# EAGLE design 20140217_FT_1.2b (EAGLE 6.5.0)
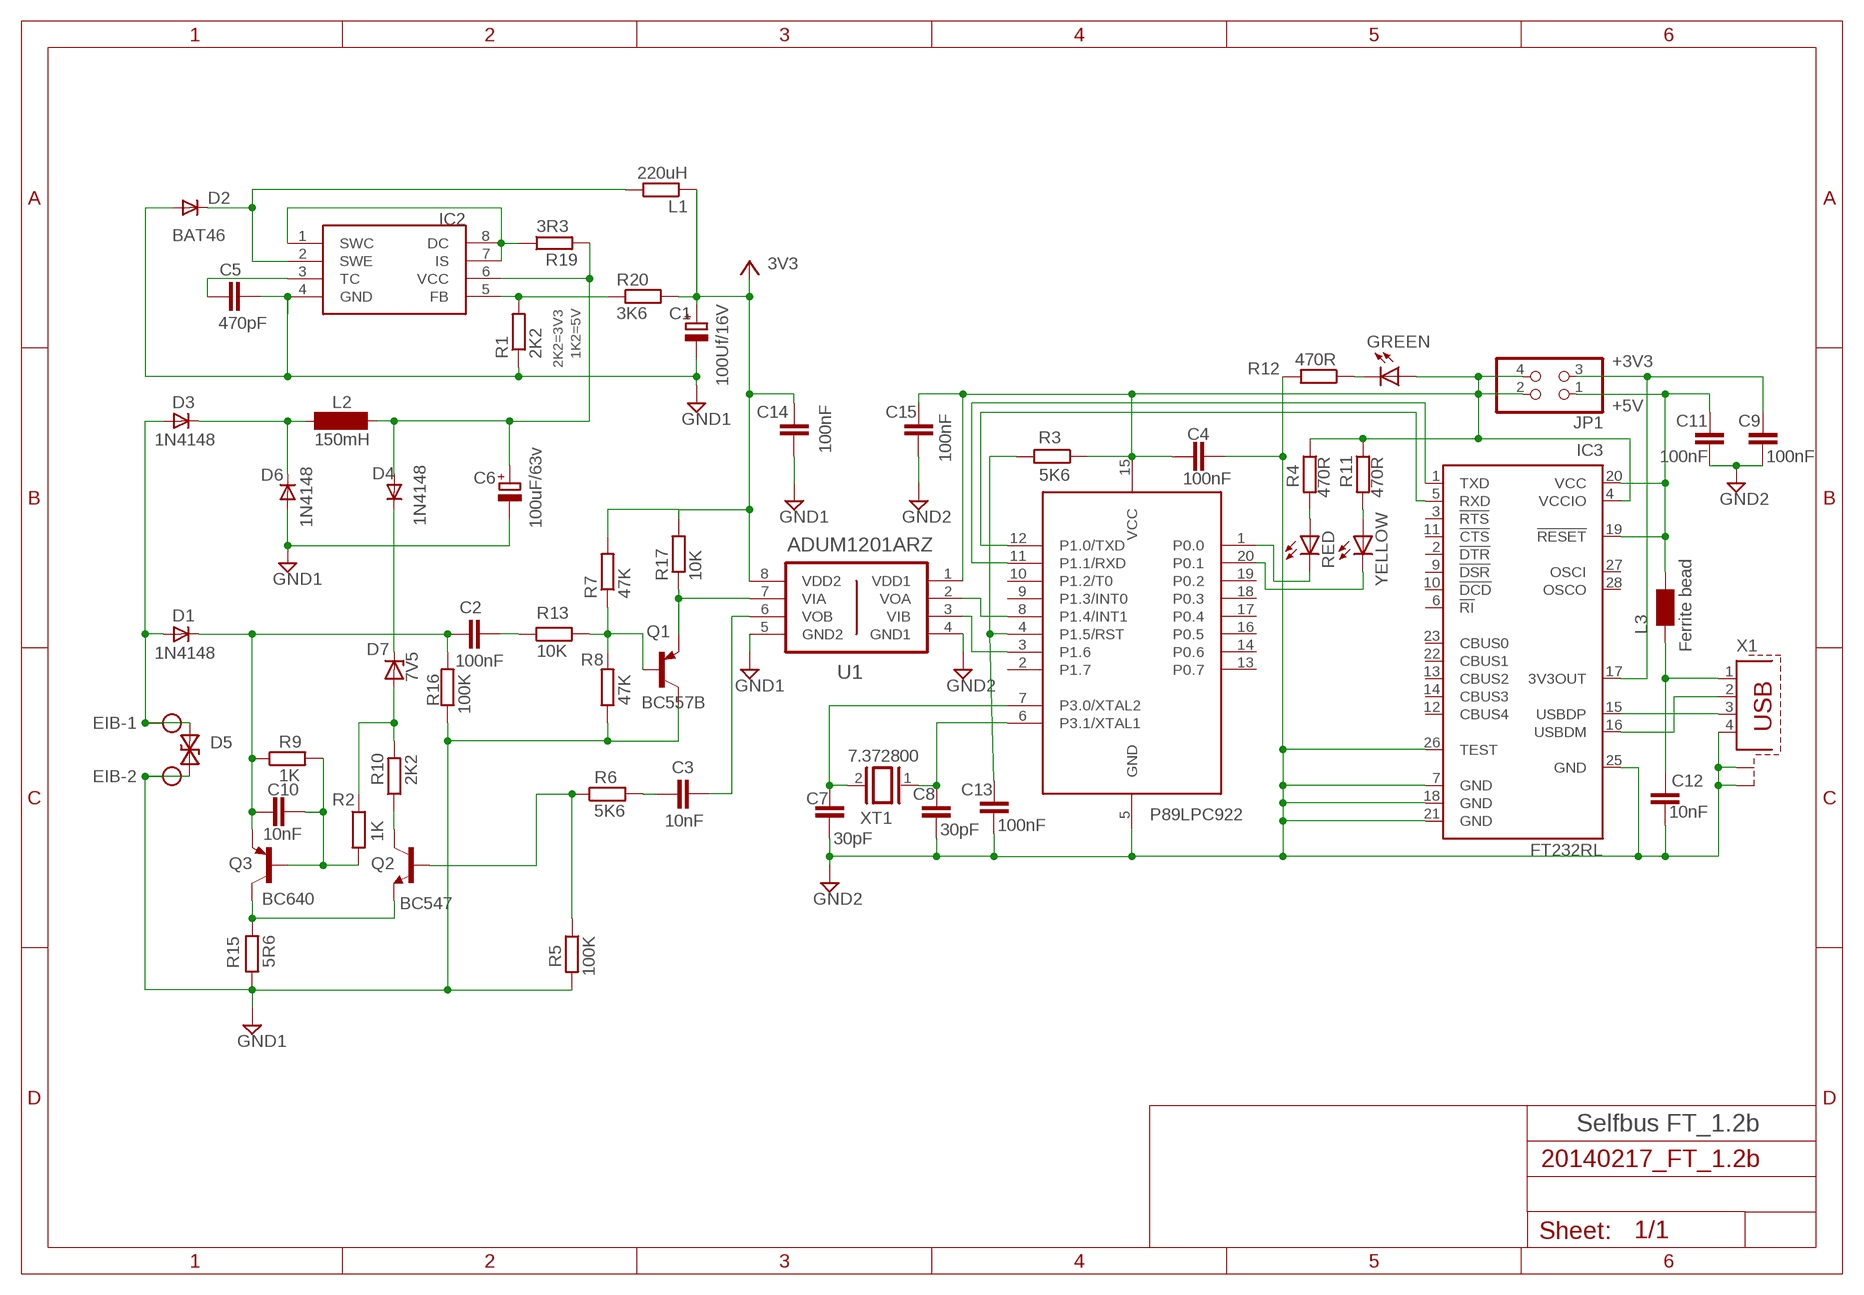
[diagram p0: schematic, sheet 1]

## Parts
C1  100Uf/16V  CPOL-EUE2.5-6  [E2,5-6]
C2  100nF  C-EUC0805  [C0805]
C3  10nF  C-EUC0805  [C0805]
C4  100nF  C-EUC0805  [C0805]
C5  470pF  C-EUC0805  [C0805]
C6  100uF/63v  CPOL-EUE5-8.5  [E5-8,5]
C7  30pF  C-EUC0805  [C0805]
C8  30pF  C-EUC0805  [C0805]
C9  100nF  C-EUC0805  [C0805]
C10  10nF  C-EUC0805  [C0805]
C11  100nF  C-EUC0805  [C0805]
C12  10nF  C-EUC0805  [C0805]
C13  100nF  C-EUC0805  [C0805]
C14  100nF  C-EUC0805  [C0805]
C15  100nF  C-EUC0805  [C0805]
D1  1N4148  LL4148  [SOD80_DO213AA_MINIMELF]
D2  BAT46  LL4148  [SOD80_DO213AA_MINIMELF]
D3  1N4148  LL4148  [SOD80_DO213AA_MINIMELF]
D4  1N4148  LL4148  [SOD80_DO213AA_MINIMELF]
D5  SMAJ43CA  [SMA]
D6  1N4148  LL4148  [SOD80_DO213AA_MINIMELF]
D7  7V5  ZENER-DIODESOD80C  [SOD80C]
EIB  MKDSN1,5/2-5,08  [MKDSN1,5/2-5,08]
GREEN  LED3MM  [LED3MM]
IC1  89LPC922  [DIL20]
IC2  MC34063AP  [DIL08]
IC3  FT232RL  [SSOP28]
JP1  PINHD-2X2  [2X02]
L1  220uH  R-EU_0207/10  [0207/10]
L2  150mH  SD12-1000  [SD12_1000]
L3  Ferrite bead  WE-CBF_0805  [0805]
Q1  BC557B  BC557  [TO92-EBC]
Q2  BC547  BC548  [TO92-EBC]
Q3  BC640  [TO92-BCE]
R1  2K2  R-EU_R0805  [R0805]
R2  1K  R-EU_R0805  [R0805]
R3  5K6  R-EU_R0805  [R0805]
R4  470R  R-EU_R0805  [R0805]
R5  100K  R-EU_R0805  [R0805]
R6  5K6  R-EU_R0805  [R0805]
R7  47K  R-EU_R0805  [R0805]
R8  47K  R-EU_R0805  [R0805]
R9  1K  R-EU_R0805  [R0805]
R10  2K2  R-EU_R0805  [R0805]
R11  470R  R-EU_R0805  [R0805]
R12  470R  R-EU_R0805  [R0805]
R13  10K  R-EU_R0805  [R0805]
R15  5R6  R-EU_0204/7  [0204/7]
R16  100K  R-EU_R0805  [R0805]
R17  10K  R-EU_R0805  [R0805]
R19  3R3  R-EU_R0805  [R0805]
R20  3K6  R-EU_R0805  [R0805]
RED  LED3MM  [LED3MM]
U1  ADUM1201ARZ  [SOIC127P600X175-8N]
X1  PN61729-S  [PN61729-S]
XT1  7.372800  XTAL/S  [QS]
YELLOW  LED3MM  [LED3MM]

## Nets
DRAIN: C2.1 C10.1 D1.C Q3.E R9.1 R16.2
N$1: C3.1 R6.2
N$2: C2.2 R13.1
N$3: IC2.5(FB) R1.2 R20.1
N$4: IC2.1(SWC) IC2.7(IS) IC2.8(DC) R19.1
N$5: C3.2 U1.6(VOB)
N$6: Q2.C R10.1
N$7: Q2.E Q3.C R15.2
N$8: D3.C D6.C L2.1
N$9: D4.C D7.C
N$12: Q2.B R5.1 R6.1
N$13: C5.1 IC2.3(TC)
N$14: Q1.B R7.1 R8.2 R13.2
N$16: D1.A D3.A D5.2 EIB.1
N$18: C4.2 C15.2 GREEN.A IC1.15(VCC) IC3.4(VCCIO) JP1.2 JP1.4 R3.1 R4.1 R11.1 U1.1(VDD1)
N$19: C8.2 IC1.6(P3.1/XTAL1) XT1.1
N$20: IC1.11(P1.1/RXD) IC3.1(TXD)
N$21: C13.2 IC1.4(P1.5/RST) R3.2
N$22: IC1.12(P1.0/TXD) IC3.5(RXD)
N$23: R4.2 RED.A
N$24: R11.2 YELLOW.A
N$25: IC1.20(P0.1) YELLOW.K(C)
N$26: IC1.1(P0.0) RED.K(C)
N$27: C11.1 IC3.19(!RESET) IC3.20(VCC) JP1.1 L3.2
N$28: IC3.15(USBDP) X1.3
N$29: IC3.16(USBDM) X1.2
N$30: C9.1 IC3.17(3V3OUT) JP1.3
N$33: C12.1 L3.1 X1.1
N$35: GREEN.K(C) R12.1
N$43: C6.+ D4.A IC2.6(VCC) L2.2 R19.2
N$46: IC1.8(P1.4/INT1) U1.2(VOA)
N$50: R7.2 R17.2
N$52: D2.C IC2.2(SWE) L1.2
N$58: IC1.3(P1.6) U1.3(VIB)
N$62: C1.- C5.2 C6.- C14.1 D2.A D5.1 D6.A EIB.2 IC2.4(GND) Q1.C R1.1 R5.2 R8.1 R15.1 R16.1 U1.5(GND2) ; supply symbol labelled GND1
N$65: C4.1 C7.1 C8.1 C9.2 C11.2 C12.2 C13.1 C15.1 IC1.5(GND) IC3.7(GND) IC3.18(GND) IC3.21(GND) IC3.25(GND) IC3.26(TEST) R12.2 U1.4(GND1) X1.4 X1.S1 X1.S2 ; supply symbol labelled GND2
N$77: C1.+ C14.2 L1.1 R20.2 U1.8(VDD2) ; supply symbol labelled 3V3
N$93: C10.2 Q3.B R2.2 R9.2
N$98: Q1.E R17.1 U1.7(VIA)
N$104: C7.2 IC1.7(P3.0/XTAL2) XT1.2
REF: D7.A R2.1 R10.2
Unconnected: IC1.2(P1.7) IC1.9(P1.3/INT0) IC1.10(P1.2/T0) IC1.13(P0.7) IC1.14(P0.6) IC1.16(P0.5) IC1.17(P0.4) IC1.18(P0.3) IC1.19(P0.2) IC3.2(!DTR) IC3.3(!RTS) IC3.6(!RI) IC3.9(!DSR) IC3.10(!DCD) IC3.11(!CTS) IC3.12(CBUS4) IC3.13(CBUS2) IC3.14(CBUS3) IC3.22(CBUS1) IC3.23(CBUS0) IC3.27(OSCI) IC3.28(OSCO)

## Notes on the sheet
- 1K2=5V
- 2K2=3V3 | +3V3
- +5V
- P89LPC922
- Selfbus FT_1.2b

## Library data of the parts
C1 C6 = rcl:CPOL-EU: POLARIZED CAPACITOR, European symbol
C2-C5 C7-C15 = rcl:C-EU: CAPACITOR, European symbol
D1-D4 D6 = diodes_smd:LL4148: 1N4148 General Purpose Rectifie SMD-Version of 1N4148 Case: SOD 80 = DO 213 AA = MINIMELF (Glass) Author: Dipl.-Ing. FH Rainer Bayer HHN Hochschule Heilbronn, rainer.bayer@hs-heilbronn.de Ingenieurbüro ing-rb, mail@ing-rb.de
D5 = SMAJ_SM6T_P6SMB:SMAJ*CA: SMAJxxCA Series of bidirectional Transient Voltage Suppressor Diodes xx = Stand-off Voltage VR in Volts; PPM = 400 W (300 W) @ 10/1000 us; IFSM = 40 A Case: SMA = DO214 AC Author: Dipl.-Ing. FH Rainer Bayer, www.ing-rb.de/hhn Feedback: rainer.bayer@hs-heilbronn.de
D7 = diode:ZENER-DIODE: Z-Diode
EIB = con-phoenix-508:MKDSN1,5/2-5,08: MKDSN 1,5/ 2-5,08 Printklemme Nennstrom: 13,5 A Nennspannung: 250 V Rastermaß: 5,08 mm Polzahl: 2 Anschlussart: Schraubanschluss Montage: Löten Anschlussrichtung Leiter/Platine: 0 ° Artikelnummer: 1729128 Source: http://eshop.phoenixcontact.com .. 1729128.pdf; MPN: MKDSN 1,5/2-5.08; OC_FARNELL: 1792903; OC_NEWARK: 30M2397
GREEN RED YELLOW = led:LED: LED OSRAM: - CHIPLED LG R971, LG N971, LY N971, LG Q971, LY Q971, LO R971, LY R971 LH N974, LH R974 LS Q976, LO Q976, LY Q976 LO Q996 - Hyper CHIPLED LW Q18S LB Q993, LB Q99A, LB R99A - SideLED LS A670, LO A670, LY A670, LG A670, LP A670 LB A673, LV A673, LT A673, LW A673 LH A674 LY A675 LS A676, LA A676, LO A676, LY A676, LW A676 LS A679, LY A679, LG A679 - Hyper Micro SIDELED® LS Y876, LA Y876, LO Y876, LY Y876 LT Y87S - SmartLED LW L88C, LW L88S LB L89C, LB L89S, LG L890 LS L89K, LO L89K, LY L89K LS L896, LA L896, LO L896, LY L896 - TOPLED LS T670, LO T670, LY T670, LG T670, LP T670 LSG T670, LSP T670, LSY T670, LOP T670, LYG T670 LG T671, LOG T671, LSG T671 LB T673, LV T673, LT T673, LW T673 LH T674 LS T676, LA T676, LO T676, LY T676, LB T676, LH T676, LSB T676, LW T676 LB T67C, LV T67C, LT T67C, LS T67K, LO T67K, LY T67K, LW E67C LS E67B, LA E67B, LO E67B, LY E67B, LB E67C, LV E67C, LT E67C LW T67C LS T679, LY T679, LG T679 LS T770, LO T770, LY T770, LG T770, LP T770 LB T773, LV T773, LT T773, LW T773 LH T774 LS E675, LA E675, LY E675, LS T675 LS T776, LA T776, LO T776, LY T776, LB T776 LHGB T686 LT T68C, LB T68C - Hyper Mini TOPLED® LB M676 - Mini TOPLED Santana® LG M470 LS M47K, LO M47K, LY M47K Source: http://www.osram.convergy.de LUXEON: - LUMILED® LXK2-PW12-R00, LXK2-PW12-S00, LXK2-PW14-U00, LXK2-PW14-V00 LXK2-PM12-R00, LXK2-PM12-S00, LXK2-PM14-U00 LXK2-PE12-Q00, LXK2-PE12-R00, LXK2-PE12-S00, LXK2-PE14-T00, LXK2-PE14-U00 LXK2-PB12-K00, LXK2-PB12-L00, LXK2-PB12-M00, LXK2-PB14-N00, LXK2-PB14-P00, LXK2-PB14-Q00 LXK2-PR12-L00, LXK2-PR12-M00, LXK2-PR14-Q00, LXK2-PR14-R00 LXK2-PD12-Q00, LXK2-PD12-R00, LXK2-PD12-S00 LXK2-PH12-R00, LXK2-PH12-S00 LXK2-PL12-P00, LXK2-PL12-Q00, LXK2-PL12-R00 Source: www.luxeon.com KINGBRIGHT: KA-3528ASYC Source: www.kingbright.com
IC1 = micro-philips:89LPC922
IC2 = mc34063:MC34063
IC3 = ftdichip:FT232R: Source: http://www.ftdichip.com/Documents/DataSheets/DS_FT232R_v104.pdf
JP1 = pinhead:PINHD-2X2: PIN HEADER
L1 R1-R13 R15-R17 R19 R20 = rcl:R-EU_: RESISTOR, European symbol
L2 = inductor-neosid:SD12: INDUCTOR nominal inductance
L3 = wuerth-elektronik:WE-CBF: SMD EMI Suppression Ferrite Beads - excellent anti-EMI properties - low DCR - impedances till 3000 ohms - rated current up to 6 A
Q1 = transistor-pnp:BC557*: PNP Transistror
Q2 = transistor-npn:BC548*: NPN Transistor
Q3 = transistor-pnp:BC640*: PNP Transistror
U1 = ADUM1201ARZ:ADUM1201ARZ: Dual-Channel Digital Isolators; MPN: ADUM1201ARZ; OC_FARNELL: 1078200; OC_NEWARK: 19M0753; PACKAGE: SOIC-8; SUPPLIER: Analog Devices
X1 = con-berg:PN61729-S: BERG USB connector; OC_FARNELL: unknown; OC_NEWARK: unknown
XT1 = special:XTAL/S: CRYSTAL

## Board
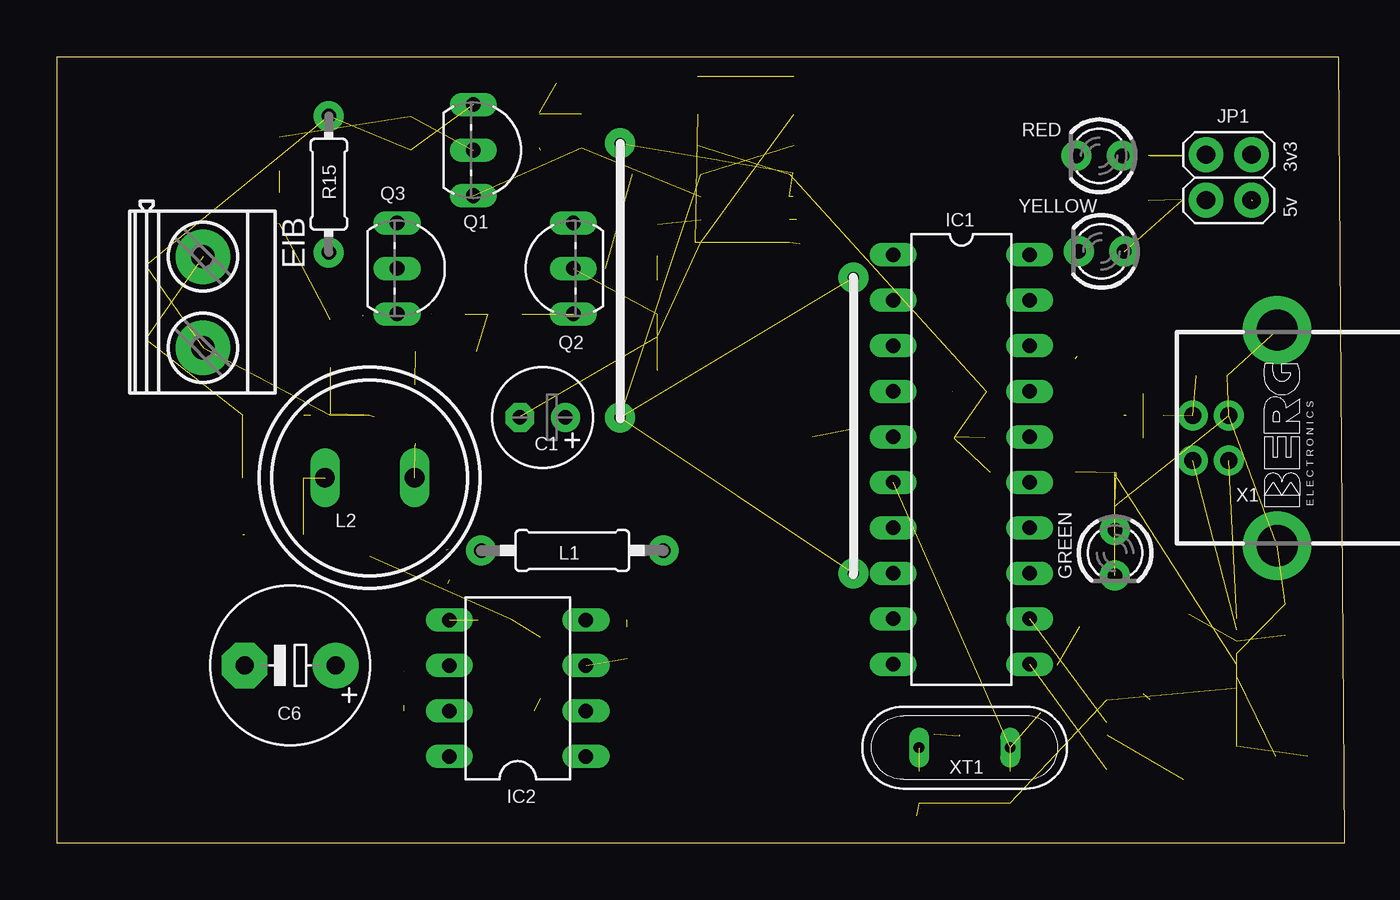
[diagram p1: board, top side]
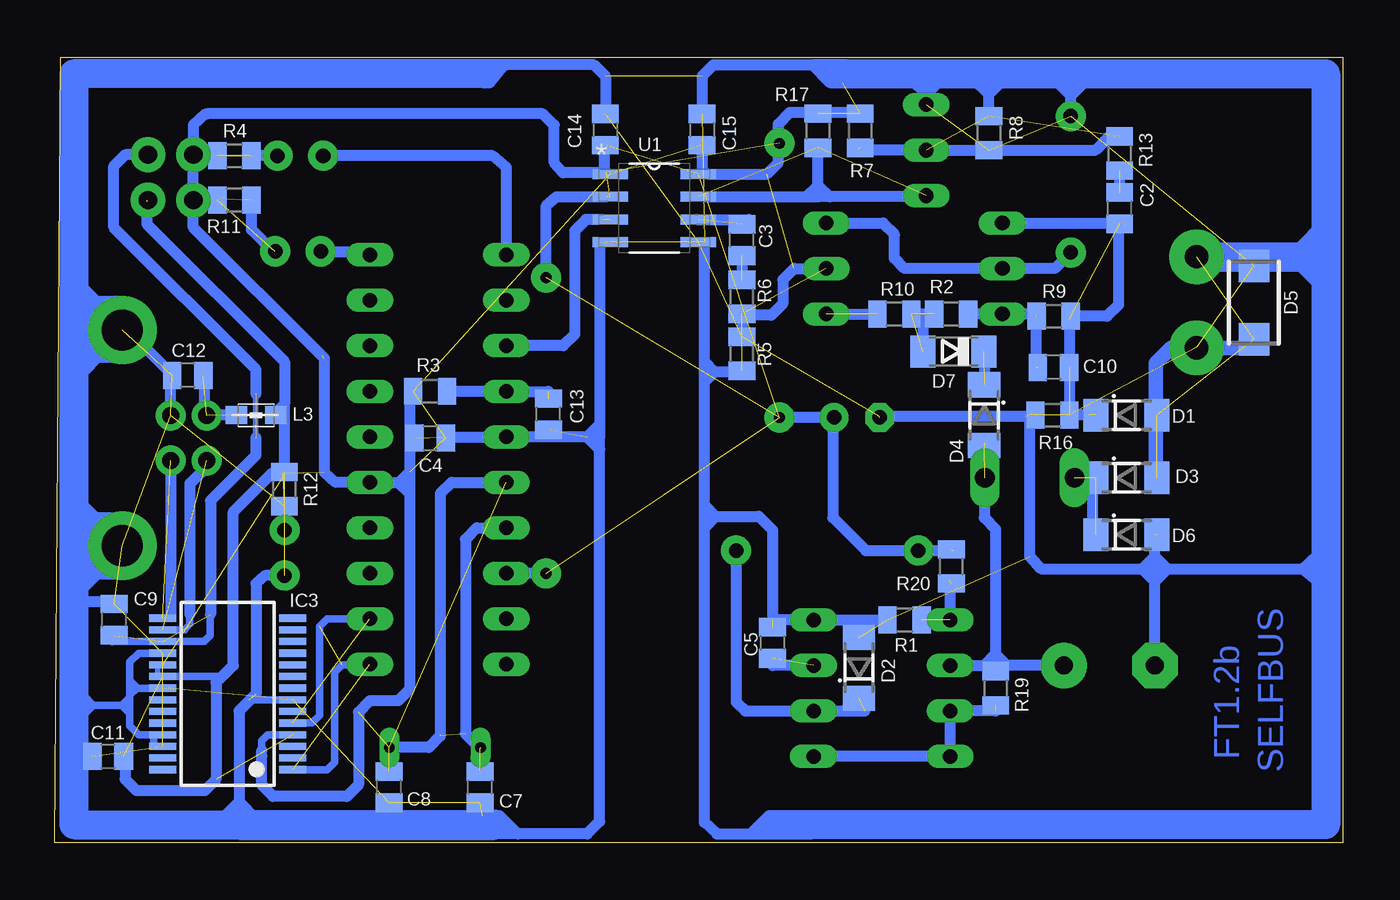
[diagram p2: board, bottom side, seen from below]

Size 71.86 x 43.87 mm. Coordinates in mm from the lower left corner, seen from the top.
Outline: 0,0 71.86,0 71.54,43.87 0,43.87 0,0
Copper layers (1*16): Top 0.035mm / dielectric 1.5mm / Bottom 0.035mm
Design rules "default": minimum track width 10mil, minimum drill 24mil, track to track 8mil, track to pad 8mil, pad to pad 8mil, via to via 8mil, smd to smd 8mil, copper to edge 40mil, drill to drill 8mil, minimum pad ring 10mil, minimum via ring 8mil, stop-mask expansion 4mil, vias tented up to drill 0mil, thermal gap 10mil

### Footprints (pad centres in the part's own frame; a part is rotated, then mirrored left to right if it is on the bottom)
E2,5-6 = drill 0.813 pad 1.6: + -1.27,0 | drill 0.813 pad 1.6 octagon: - 1.27,0
C0805 = smd 1.041 x 1.5: 1 -0.874,0 | smd 1.016 x 1.5: 2 0.874,0
E5-8,5 = drill 1.016 pad 2.54: + -2.54,0 | drill 1.016 pad 2.54 octagon: - 2.54,0
SOD80_DO213AA_MINIMELF = smd 1.4 x 1.8: A 1.7,0; C -1.7,0
SMA = smd 1.8 x 1.7: 1 -2.05,0; 2 2.05,0
SOD80C = smd 1.4 x 1.8: A 1.7,0; C -1.7,0
MKDSN1,5/2-5,08 = drill 1.3 pad 3.048: 1 -2.561,0.025; 2 2.519,0.025
LED3MM = drill 0.813 pad 1.676: A -1.27,0; K 1.27,0
DIL20 = drill 0.813 long: 1 -11.43,-3.81; 2 -8.89,-3.81; 3 -6.35,-3.81; 4 -3.81,-3.81; 5 -1.27,-3.81; 6 1.27,-3.81; 7 3.81,-3.81; 8 6.35,-3.81; 9 8.89,-3.81; 10 11.43,-3.81; 11 11.43,3.81; 12 8.89,3.81; 13 6.35,3.81; 14 3.81,3.81; 15 1.27,3.81; 16 -1.27,3.81; 17 -3.81,3.81; 18 -6.35,3.81; 19 -8.89,3.81; 20 -11.43,3.81
DIL08 = drill 0.813 long: 1 -3.81,-3.81; 2 -1.27,-3.81; 3 1.27,-3.81; 4 3.81,-3.81; 5 3.81,3.81; 6 1.27,3.81; 7 -1.27,3.81; 8 -3.81,3.81
SSOP28 = smd 0.4 x 1.5: 1 -4.225,-3.625; 2 -3.575,-3.625; 3 -2.925,-3.625; 4 -2.275,-3.625; 5 -1.625,-3.625; 6 -0.975,-3.625; 7 -0.325,-3.625; 8 0.325,-3.625; 9 0.975,-3.625; 10 1.625,-3.625; 11 2.275,-3.625; 12 2.925,-3.625; 13 3.575,-3.625; 14 4.225,-3.625; 15 4.225,3.625; 16 3.575,3.625; 17 2.925,3.625; 18 2.275,3.625; 19 1.625,3.625; 20 0.975,3.625; 21 0.325,3.625; 22 -0.325,3.625; 23 -0.975,3.625; 24 -1.625,3.625; 25 -2.275,3.625; 26 -2.925,3.625; 27 -3.575,3.625; 28 -4.225,3.625
2X02 = drill 1.016 pad 1.93: 1 -1.27,-1.27; 2 -1.27,1.27; 3 1.27,-1.27; 4 1.27,1.27
0207/10 = drill 0.813 pad 1.676: 1 -5.08,0; 2 5.08,0
SD12_1000 = drill 1.1 long: 1 -2.5,0; 2 2.5,0
0805 = smd 1.2 x 1: 1 -1.1,0; 2 1.1,0
TO92-EBC = drill 0.813 long: B 0,-1.27; C -2.54,-1.27; E 2.54,-1.27
TO92-BCE = drill 0.813 long: B 2.54,0; C 0,0; E -2.54,0
R0805 = smd 1.016 x 1.5: 1 -0.95,0; 2 0.95,0
0204/7 = drill 0.813 pad 1.676: 1 -3.81,0; 2 3.81,0
SOIC127P600X175-8N = smd 1.981 x 0.559: 1 -2.464,1.905; 2 -2.464,0.635; 3 -2.464,-0.635; 4 -2.464,-1.905; 5 2.464,-1.905; 6 2.464,-0.635; 7 2.464,0.635; 8 2.464,1.905
PN61729-S = drill 0.95 pad 1.676: 1 1.25,4.71; 2 -1.25,4.71; 3 -1.25,2.71; 4 1.25,2.71 | drill 2.3 pad 3.81: S1 -6.02,0; S2 6.02,0
QS = drill 0.61 long: 1 -2.54,0; 2 2.54,0

### Placement (x,y rotation side)
C1  27.11,23.75 180 top
C2  12.45,35.43 90 bottom
C3  33.53,33.66 90 bottom
C4  50.93,22.61 0 bottom
C5  31.81,11.18 90 bottom
C6  13.02,9.91 180 top
C7  48.13,3.11 90 bottom
C8  53.21,3.11 90 bottom
C9  68.55,12.47 90 bottom
C10  16.13,26.54 180 bottom
C11  68.9,4.83 180 bottom
C12  64.45,26.1 180 bottom
C13  44.32,23.94 90 bottom
C14  41.15,39.81 270 bottom
C15  35.75,39.81 270 bottom
D1  12.06,23.88 0 bottom
D2  26.99,9.78 90 bottom
D3  12.06,20.38 0 bottom
D4  20,23.88 270 bottom
D5  4.95,30.16 270 bottom
D6  12.06,17.21 0 bottom
D7  21.72,27.43 180 bottom
EIB  8.13,30.16 270 top
GREEN  59.05,16.19 270 top
IC1  50.48,21.4 270 top
IC2  25.72,8.64 90 top
IC3  62.23,8.32 90 bottom
JP1  65.41,37.15 90 top
L1  28.77,16.32 0 top
L2  17.46,20.38 0 top
L3  60.64,23.88 0 bottom
Q1  24.51,38.67 270 top
Q2  27.56,32.07 90 top
Q3  18.99,32.07 270 top
R1  24.45,12.45 0 bottom
R2  21.84,29.53 0 bottom
R3  50.93,25.21 0 bottom
R4  61.85,38.35 180 bottom
R5  33.53,27.3 90 bottom
R6  33.53,30.48 90 bottom
R7  26.92,39.75 90 bottom
R8  19.75,39.62 90 bottom
R9  16.13,29.4 180 bottom
R10  25.02,29.53 0 bottom
R11  61.85,35.88 180 bottom
R12  59.05,19.75 270 bottom
R13  12.45,38.48 90 bottom
R15  15.18,36.77 270 top
R16  16.19,23.88 180 bottom
R17  29.27,39.75 90 bottom
R19  19.37,8.64 90 bottom
R20  21.84,15.43 90 bottom
RED  58.17,38.35 180 top
U1  38.42,35.43 0 bottom
X1  68.1,22.61 90 top
XT1  50.66,5.32 180 top
YELLOW  58.29,33.02 180 top

### Tracks (layer width: path | path; a pad name or v marks a point on that pad's centre or on a via)
DRAIN  (7 unrouted)
  Bottom 0.61: 13.46,24.51 14.16,23.88 15.24,23.88 | 15.24,29.21 15.24,23.94 | Q3.E 12.26,34.61
N$1  (1 unrouted)
N$2  (1 unrouted)
N$3  (2 unrouted)
  Bottom 0.61: 21.91,14.67 IC2.5
N$4  (1 unrouted)
  Bottom 0.61: 19.37,7.37 IC2.7 IC2.8 IC2.1
N$5  (1 unrouted)
N$6  (1 unrouted)
N$7
  Bottom 0.61: R15.2 16.07,32.07 Q3.C 24.45,32.07 25.02,32.64 25.02,33.91 25.02,33.97 25.65,34.61 Q2.E
N$8  (2 unrouted)
N$9  (1 unrouted)
N$11
  Bottom 0.406: 64.35,13.18 64.35,12.23 64.61,11.89 65.5,11.89
N$12  (2 unrouted)
N$13  (1 unrouted)
N$14  (3 unrouted)
  Bottom 0.61: Q1.B 26.99,38.67
N$15
  Bottom 0.61: 15.18,29.46 15.05,29.46 15.11,29.4
N$16  (3 unrouted)
  Bottom 1.676: EIB.1 1.02,32.7
N$17
  Bottom 0.61: 35.75,38.67 35.75,37.47
N$18  (10 unrouted)
  Bottom 0.61: 62.74,35.94 62.74,35.88 JP1.2 | JP1.2 64.14,38.35 | 64.14,38.35 JP1.4 64.14,40.07 63.44,40.7 | 62.87,3.56 62.87,8.95 61.91,9.91 61.91,18.48 59.75,20.64 59.12,20.64 | 52.7,20.13 IC1.15 56.2,20.13 56.83,20.7 56.83,27.05 | 52.7,20.13 52.64,20.13 | 52.64,20.13 52.07,20.13 | JP1.2 64.14,34.35 56.96,27.18 | 59.05,18.86 GREEN.A | 62.8,38.35 64.14,38.35 | 52.64,20.13 52.07,20.7 | 52.07,19.49 52.7,20.13
N$19  (2 unrouted)
N$20  (1 unrouted)
N$21  (2 unrouted)
  Bottom 0.61: R3.2 IC1.4 44.32,25.21
N$22  (1 unrouted)
N$23  (1 unrouted)
  Bottom 0.61: RED.A 61.02,38.35
N$24  (1 unrouted)
N$25
  Bottom 0.61: YELLOW.K 54.29,33.02 IC1.20
N$26
  Bottom 0.61: RED.K 47.43,38.35 46.67,37.72 IC1.1
N$27  (5 unrouted)
  Bottom 0.61: 59.05,24.51 59.69,23.88 | 59.05,20.57 59.05,24.51 | 59.05,24.51 59.05,26.86 66.74,34.54 66.74,35.81
N$28  (1 unrouted)
N$29  (1 unrouted)
N$30  (3 unrouted)
  Bottom 0.61: 60.64,25.08 60.64,26.42 68.58,34.35 68.58,37.78 67.94,38.42 JP1.3 | 63.18,12.76 63.18,19.11 60.64,21.65 60.64,22.61
N$31
  Bottom 0.61: 41.21,38.67 41.21,37.47
N$32
  Bottom 0.813: 5.08,27.62 9.59,27.62 10.41,26.8 10.41,20.19
N$33  (2 unrouted)
N$35  (2 unrouted)
  Bottom 0.305: 58.1,8 58.93,8 59.69,8
  Bottom 0.406: 58.93,8 61.02,8
  Bottom 0.61: GREEN.K 60.13,14.92 60.64,14.48 60.64,8.32 61.59,7.37 61.59,2.29 | 61.59,2.29 61.59,1.02 | 62.23,1.65 61.59,2.29 | 61.59,2.29 60.64,1.33
  Bottom 1.626: 47.88,42.93 70.8,42.93 70.8,1.02 61.59,1.02
  Bottom 1.676: 61.59,1.02 47.31,1.02
N$36
  Bottom 0.61: 28.83,29.46 28.77,29.53 26.1,29.53
N$38
  Bottom 0.61: 23.3,36.07 28.64,36.07 | 28.64,36.07 29.27,36.07 | 29.27,36.07 29.27,36.7 | 29.27,36.7 29.27,38.67 | 35.56,36.07 29.91,36.07 | 29.91,36.07 29.27,36.07 | 29.91,36.07 29.27,36.7 | 29.27,36.7 28.64,36.07
N$41
  Bottom 0.61: 64.33,12.76 64.33,20.07 63.37,21.02 63.37,21.34
N$43  (3 unrouted)
  Bottom 0.61: 20,22.29 20,18.16 19.37,17.53 19.37,10.54 | 19.37,10.54 R19.2 | IC2.6 20,9.91 | 20,9.91 18.73,9.91 | 19.37,10.54 20,9.91 | 19.37,10.54 18.73,9.91 | C6.+ 18.73,9.91
N$44
  Bottom 0.61: 13.65,20.07 13.97,20.32 | 13.97,20.32 13.97,17.53 | 14.92,20.32 13.97,20.32
N$45
  Bottom 0.813: 2.29,33.21 1.08,34.42 1.08,34.48
N$46  (via drill 0.6 pad 1.68)  (5 unrouted)
  Bottom 0.61: v44.45,15.05 IC1.8 | 41.08,37.4 43.5,37.4 44.01,37.97 44.01,40.07 44.64,40.7 63.37,40.7 | v44.45,31.56 44.45,35.56 43.88,36.07 41.08,36.07
  other vias: 31.43,39.05 31.43,23.75
N$47
  Bottom 0.61: 34.92,0.51 29.65,0.51
N$48
  Bottom 1.626: 28.07,42.93 0.95,42.93 0.95,1.02 31.37,1.02
N$49
  Bottom 0.305: 60.33,5.65 60.33,4.76
N$50  (1 unrouted)
N$51
  Bottom 0.406: 65.32,11.25 63.53,11.25 63.2,11.58 63.2,13.19
N$52  (1 unrouted)
  Bottom 0.61: L1.2 33.85,7.87 33.34,7.37 IC2.2 26.67,7.37
N$53
  Bottom 0.61: 65.41,23.88 65.41,26.1
N$56
  Bottom 0.305: 60.65,25.13 60.65,22.07
N$57
  Bottom 0.61: 22.8,29.53 23.43,29.53 | 23.43,29.53 24.13,29.53 | 23.43,29.53 23.43,27.37
N$58  (1 unrouted)
  Bottom 0.61: 41.27,34.8 42.23,34.8 42.86,34.16 42.86,28.38 43.5,27.75 IC1.3
N$60
  Bottom 0.61: 63.5,26.42 63.5,23.88 61.91,23.88
N$61
  Bottom 0.305: 66.13,9.97 66.13,9.32
N$62  (16 unrouted)
  Bottom 0.61: 17.46,23.88 17.46,16 16.83,15.3 11.18,15.3 | R1.1 IC2.4 31.81,12.45 | 11.18,15.3 9.78,15.3 | 9.78,15.3 2.22,15.3 | 2.22,15.3 1.27,15.62 | 2.22,15.3 1.4,16.07 | 2.22,15.3 1.46,14.67 | C6.- 10.48,14.61 | 10.48,14.61 10.48,16 | 10.48,16 10.48,17.21 | 10.48,16 9.78,15.3 | 9.78,15.3 10.48,14.61 | 10.48,14.61 11.18,15.3 | 11.18,15.3 10.48,16 | 17.72,23.81 25.84,23.81
N$63
  Bottom 0.61: 30.99,1.52 32,1.52 32.89,0.63 32.89,0.57
N$64
  Bottom 0.61: 12.51,39.5 12.95,39.5 13.78,38.67 23.18,38.67
N$65  (19 unrouted)
  Bottom 0.61: 41.47,33.47 41.47,23.37 | 41.47,23.37 41.47,22.67 | 50.1,22.67 IC1.5 42.16,22.67 | 41.47,22.67 42.16,22.67 | 46.04,0.51 42.16,0.51 41.47,1.21 41.47,21.97 | 46.04,0.51 47.37,0.51 | 41.47,21.97 41.47,22.67 | 34.92,0.51 35.62,1.14 35.62,17.59 | 35.62,17.59 35.62,18.22 | 35.62,18.22 35.62,18.86 | 35.62,18.86 35.62,25.72 | 35.62,25.72 35.62,26.29 | 35.62,26.29 35.62,26.86 | 35.62,26.86 35.62,33.53 | 46.04,0.51 47.05,1.52 48.01,1.52 | 42.16,22.67 41.47,23.37 | 42.16,22.67 41.47,21.97 | 33.53,26.29 35.05,26.29 | 35.05,26.29 35.62,26.29 | 35.62,18.22 34.99,18.22 | 34.99,18.22 32.58,18.22 31.81,17.46 31.81,12 | 35.05,26.29 35.62,25.72 | 35.05,26.29 35.62,26.86 | 34.99,18.22 35.62,18.86 | 34.99,18.22 35.62,17.59
N$66
  Bottom 0.406: 65.47,9.29 62.41,9.29
N$67  (3 unrouted)
  Bottom 0.61: 35.43,37.34 32.13,37.34 31.5,37.97 31.5,40.13 30.86,40.77 26.92,40.77 | 28.83,32.07 30.61,32.07 31.24,31.43 31.24,30.1 31.88,29.46 33.47,29.46 | 27.88,42.42 28.57,42.42 29.59,43.43 | 27.62,43.43 29.59,43.43 | 29.59,43.43 35.12,43.43 35.75,42.8 35.75,40.83 | 46.8,43.43 47.62,42.42 | 46.8,43.43 46.67,43.43 41.78,43.43 41.15,42.8 41.15,40.77 | 46.8,43.43 48.26,43.43
N$68
  Bottom 0.61: 19.75,40.64 19.75,41.78 | 19.75,41.78 19.75,43.05 | 19.75,41.78 20.64,42.67 20.64,42.74 | 19.75,41.78 18.92,42.61 18.92,42.67
N$69
  Bottom 0.61: 59.63,32.96 60.9,34.23 60.9,35.94
N$70
  Bottom 0.61: 23.24,41.27 23.24,41.78 | 23.24,41.78 23.24,42.67 | 23.24,41.78 24.07,42.61 24.13,42.61 | 23.24,41.78 22.42,42.61
N$71
  Bottom 0.61: 67.94,4.83 67.94,3.56 67.31,2.92 63.5,2.92 62.87,3.56
N$72
  Bottom 0.305: 63.44,21.27 64.01,20.51
N$73
  Bottom 0.406: 68.66,11.23 67.12,11.24 66.48,11.24
N$74
  Bottom 0.406: 65.85,10.59 67.18,10.59 67.69,10.1 67.69,9.08 | 67.69,9.08 67.69,8.64 | 67.69,8.64 67.69,8.26 | 67.69,8.26 67.69,8.13 | 67.69,8.13 67.69,7.68 | 67.69,7.68 67.69,7.24 | 67.69,7.24 67.69,6.54 67.18,6.04 66.36,6.04 66.36,5.4 | 65.85,8.64 67.25,8.64 | 67.25,8.64 67.31,8.64 | 67.31,8.64 67.69,8.64 | 67.25,8.64 67.69,9.08 | 67.31,8.64 67.69,8.26 | 67.69,7.68 68.14,7.68 | 68.14,7.68 69.72,7.68 | 69.72,7.68 70.55,7.68 | 69.72,7.68 70.29,8.26 | 69.72,7.68 70.23,7.18 | 68.14,7.68 67.69,8.13 | 68.14,7.68 67.69,7.24
N$76
  Bottom 0.61: 28,43.37 arc-90 28.07,43.43 28.13,43.43
N$77  (3 unrouted)
  Bottom 0.61: 21.72,16.32 L1.1 26.61,16.32 28.45,18.16 28.45,23.75 | C1.+ 28.45,23.75 | 28.45,23.75 31.43,23.75
N$79
  Bottom 0.61: 68.58,13.4 68.64,13.46 70.55,13.46
N$81
  Bottom 0.61: 25.4,12.38 25.27,12.26
N$82
  Bottom 0.61: 67.94,30.16 67.94,30.23 69.53,30.23 | 69.53,30.23 70.87,30.23 70.87,27.11 69.47,27.11 | 69.47,27.11 67.82,27.11 | 69.47,27.11 70.23,26.35 70.36,26.35 | 69.53,30.23 70.36,31.05 70.36,31.24
N$83
  Bottom 0.61: 68.9,29.78 68.9,29.72 70.23,29.72
N$84
  Bottom 0.61: 69.6,29.21 69.6,29.27 70.1,29.27 70.1,27.5 69.6,27.5
N$85
  Bottom 0.61: 65.34,26.16 67.69,28.51 68.58,28.51
N$86
  Bottom 0.61: 68.07,14.99 70.55,14.99 70.55,18.03 70.42,18.16 67.82,18.16
N$87
  Bottom 0.61: 69.28,17.84 69.47,17.65 69.85,17.65 | 69.85,17.65 70.42,17.65 | 69.85,17.65 69.79,17.59 69.79,15.24
N$88
  Bottom 0.61: 69.6,14.92 70.36,14.16
N$89
  Bottom 0.61: 69.66,18.22 70.36,18.92 70.42,18.92
N$90
  Bottom 0.61: 31.88,1.14 32.32,0.7 32.38,0.7
N$91
  Bottom 0.61: 15.18,40.51 15.18,41.72 | 15.18,41.72 15.18,42.67 | 15.18,41.72 14.29,42.61 | 15.18,41.72 15.81,42.35
N$92
  Bottom 0.61: 10.41,23.81 10.41,20.07
N$93  (3 unrouted)
  Bottom 0.61: 17.08,26.54 17.08,29.46 17.14,29.53 Q3.B 19.11,29.53 R2.2
N$94
  Bottom 0.61: 65.41,21.34 65.41,12.7
N$95
  Bottom 0.61: 20,27.56 20,25.53
N$97
  Bottom 0.61: 36.07,34.8 33.15,34.8
N$98  (2 unrouted)
N$99
  Bottom 0.61: 33.53,32.77 33.53,31.43
N$101
  Bottom 0.61: 33.53,29.4 33.53,28.26
N$102  (1 unrouted)
  Bottom 0.406: 54.34,9.96 54.34,9.94 55.84,9.94 56.26,9.53 56.26,4.51 56.68,4.09 58.62,4.09 | 56.68,12.51 57.1,12.09 57.1,7.11 57.52,6.69 58.32,6.69
N$103
  Bottom 0.406: 56.67,12.51 54.23,12.51
N$104  (5 unrouted)
  Bottom 0.406: 58.78,6.04 59.98,6.04 60.33,5.7 60.33,4.85
  Bottom 0.61: 52.07,25.59 52.07,8.57 52.7,7.94 54.29,7.94 54.93,7.3 54.93,3.24 55.56,2.6 59.69,2.6 60.33,3.24 60.33,4.85 60.33,5.14 | 50.35,5.97 50.99,5.33 53.21,5.33 | 46.67,20.13 49.72,20.13 50.35,19.49 50.35,6.03 | 48.13,5.27 48.96,6.1 48.96,16.95 48.32,17.59 IC1.7
N$105
  Bottom 0.61: 12.51,34.48 12.51,30.03 13.14,29.4 15.18,29.4
N$106
  Bottom 0.61: 12.45,36.51 12.45,37.4
N$107
  Bottom 0.813: 2.35,32.26 2.29,32.26 | 2.16,32.26 2.29,32.26 | 2.29,32.26 0.89,30.86
N$108
  Bottom 0.61: 29.59,9.91 31.81,9.91
REF  (2 unrouted)

### Text on the board
Bottom: FT1.2b | SELFBUS
tNames: 3v3 | 5v